# EAGLE design MYO Ganglion no usb (EAGLE 6.1)

## Sheet 1 of 2
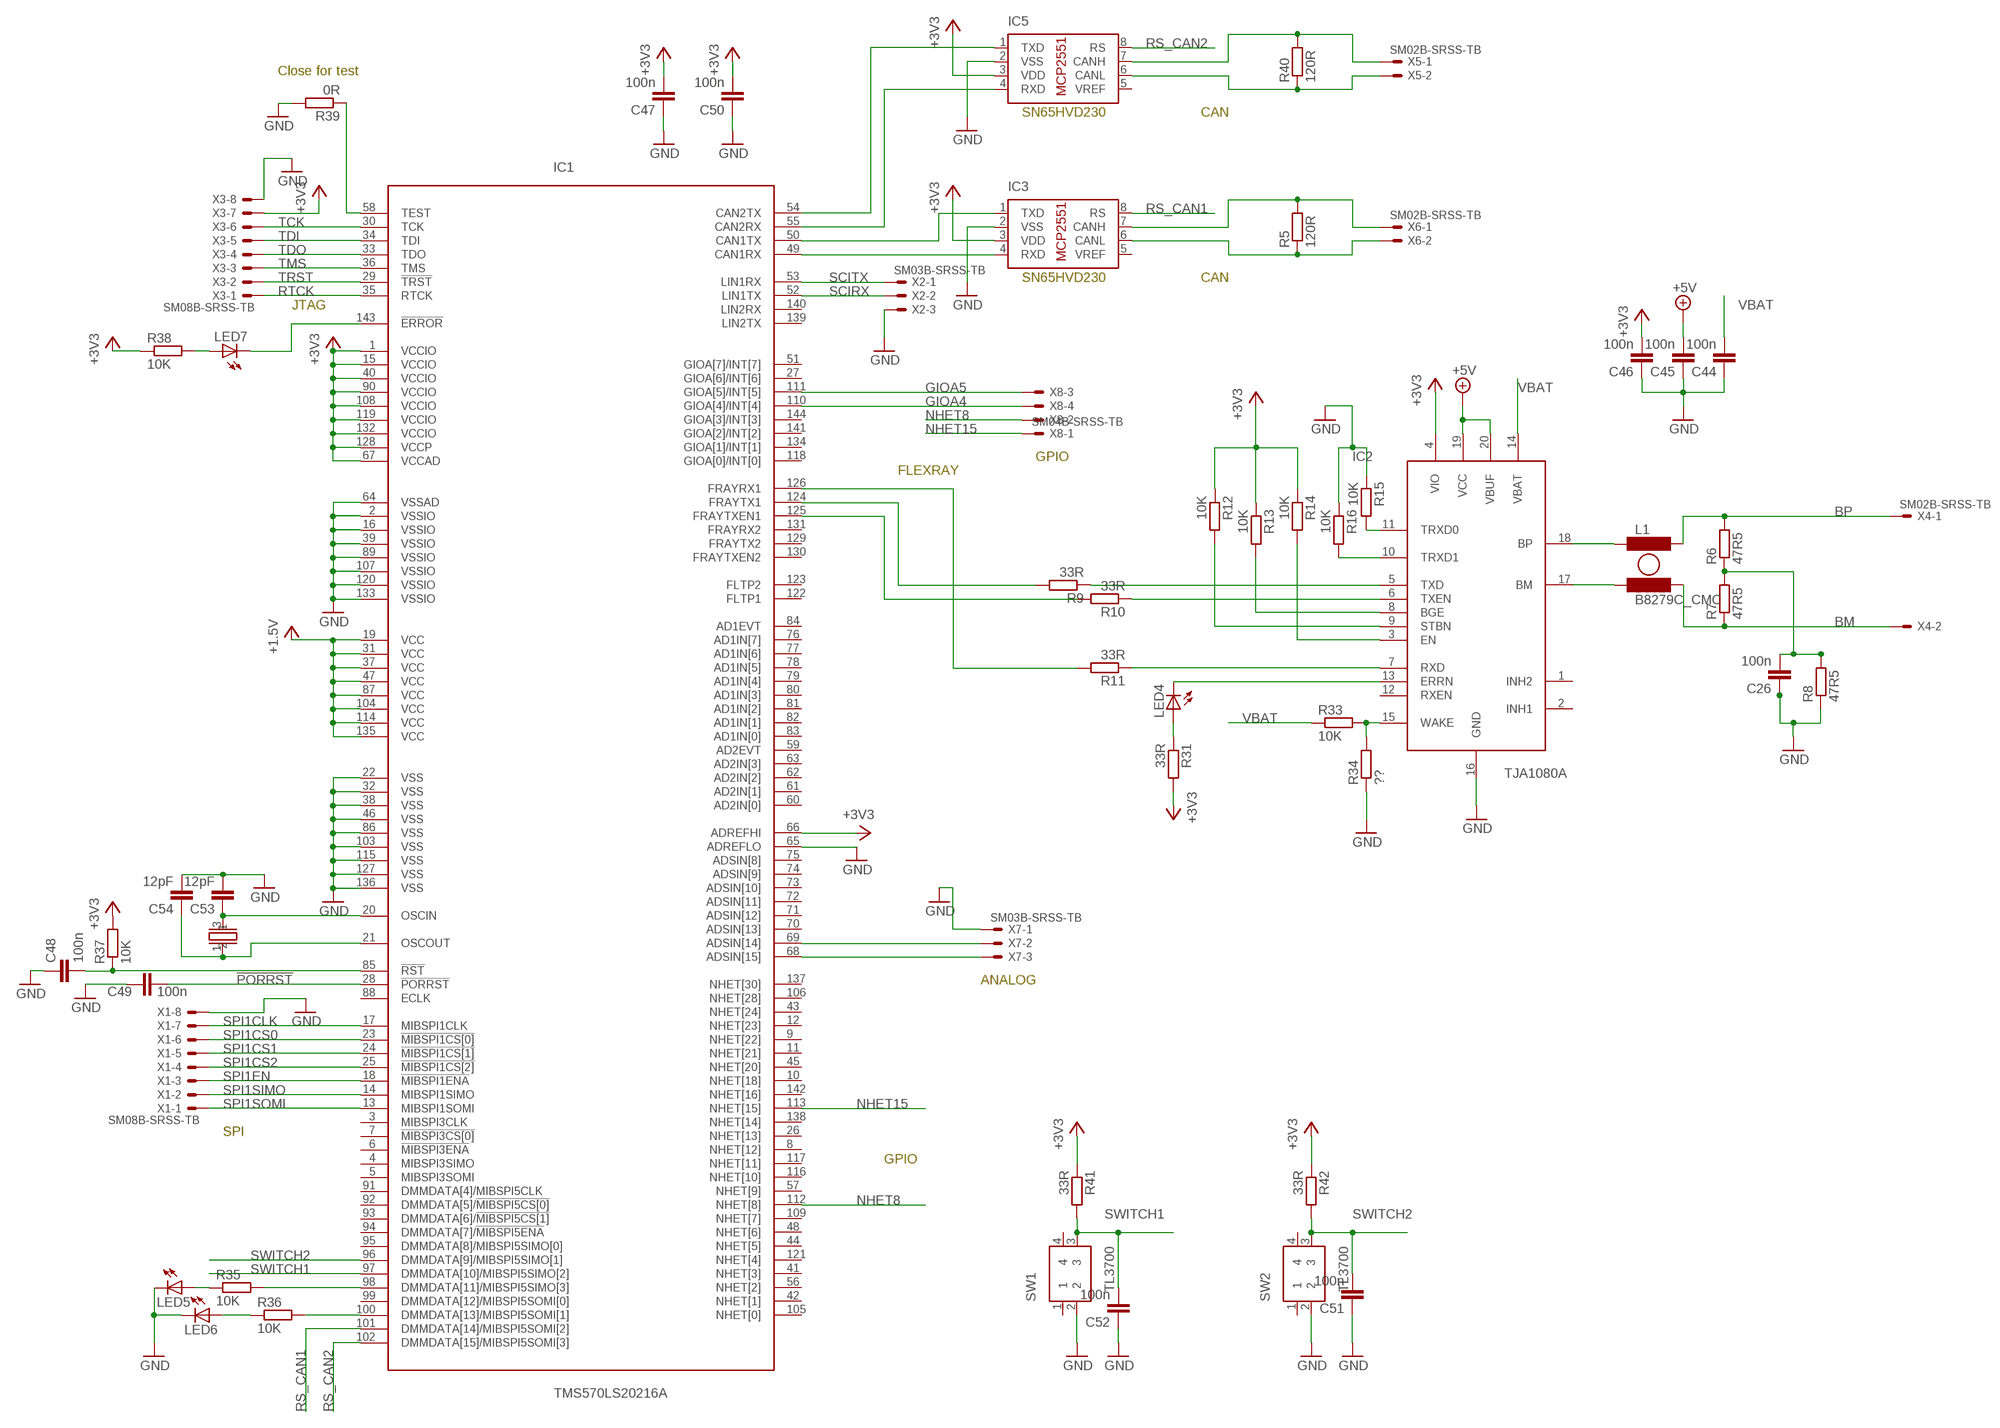
[diagram p0: schematic, sheet 1]

### Parts
C26  100n  C-EUC0402K  [C0402K]
C44  100n  C-EUC0402K  [C0402K]
C45  100n  C-EUC0402K  [C0402K]
C46  100n  C-EUC0402K  [C0402K]
C47  100n  C-EUC0402K  [C0402K]
C48  100n  C-EUC0402K  [C0402K]
C49  100n  C-EUC0402K  [C0402K]
C50  100n  C-EUC0402K  [C0402K]
C51  100n  C-EUC0402K  [C0402K]
C52  100n  C-EUC0402K  [C0402K]
C53  12pF  C-EUC0402K  [C0402K]
C54  12pF  C-EUC0402K  [C0402K]
IC1  TMS570LS20216A  [PQFP144]
IC2  TJA1080A  [TSSOP20]
IC3  MCP2551/SN  [SO08]
IC5  MCP2551/SN  [SO08]
L1  B8279C_CMC  [1812CMC]
LED4  LEDCHIPLED_0805  [CHIPLED_0805]
LED5  LEDCHIPLED_0805  [CHIPLED_0805]
LED6  LEDCHIPLED_0805  [CHIPLED_0805]
LED7  LEDCHIPLED_0805  [CHIPLED_0805]
R5  120R  R-EU_R0603  [R0603]
R6  47R5  R-EU_R0402  [R0402]
R7  47R5  R-EU_R0402  [R0402]
R8  47R5  R-EU_R0402  [R0402]
R9  33R  R-EU_R0402  [R0402]
R10  33R  R-EU_R0402  [R0402]
R11  33R  R-EU_R0402  [R0402]
R12  10K  R-EU_R0402  [R0402]
R13  10K  R-EU_R0402  [R0402]
R14  10K  R-EU_R0402  [R0402]
R15  10K  R-EU_R0402  [R0402]
R16  10K  R-EU_R0402  [R0402]
R31  33R  R-EU_R0402  [R0402]
R33  10K  R-EU_R0402  [R0402]
R34  ??  R-EU_R0402  [R0402]
R35  10K  R-EU_R0402  [R0402]
R36  10K  R-EU_R0402  [R0402]
R37  10K  R-EU_R0402  [R0402]
R38  10K  R-EU_R0402  [R0402]
R39  0R  R-EU_R0402  [R0402]
R40  120R  R-EU_R0603  [R0603]
R41  33R  R-EU_R0402  [R0402]
R42  33R  R-EU_R0402  [R0402]
SW1  TL3700  [TL3700]
SW2  TL3700  [TL3700]
X1  SM08B-SRSS-TB  [SM08B-SRSS-TB]
X2  SM03B-SRSS-TB  [SM03B-SRSS-TB]
X3  SM08B-SRSS-TB  [SM08B-SRSS-TB]
X4  SM02B-SRSS-TB  [SM02B-SRSS-TB]
X5  SM02B-SRSS-TB  [SM02B-SRSS-TB]
X6  SM02B-SRSS-TB  [SM02B-SRSS-TB]
X7  SM03B-SRSS-TB  [SM03B-SRSS-TB]
X8  SM04B-SRSS-TB  [SM04B-SRSS-TB]
XT1  2.5X2_XTAL  [2.5X2_XTAL]

### Nets
!PORRST: C49.2 IC1.28(!PORRST) ; also sheet 2
+1V5: IC1.19(VCC) IC1.31(VCC) IC1.37(VCC) IC1.47(VCC) IC1.87(VCC) IC1.104(VCC) IC1.114(VCC) IC1.135(VCC) ; supply symbol labelled +1.5V ; also sheet 2
+3V3 [power]: C46.2 C47.2 C50.2 IC1.1(VCCIO) IC1.15(VCCIO) IC1.40(VCCIO) IC1.66(ADREFHI) IC1.67(VCCAD) IC1.90(VCCIO) IC1.108(VCCIO) IC1.119(VCCIO) IC1.128(VCCP) IC1.132(VCCIO) IC2.4(VIO) IC3.3(VDD) IC5.3(VDD) R12.1 R13.1 R14.1 R31.2 R37.2 R38.1 R41.1 R42.1 X3.7 ; also sheet 2
+5V [power]: C45.2 IC2.19(VCC) IC2.20(VBUF) ; also sheet 2
BM: L1.4 R7.1 X4.2
BP: L1.2 R6.2 X4.1
GIOA4: IC1.110(GIOA[4]/INT[4]) X8.4
GIOA5: IC1.111(GIOA[5]/INT[5]) X8.3
GND: C26.1 C44.1 C45.1 C46.1 C47.1 C48.1 C49.1 C50.1 C51.1 C52.1 C53.2 C54.2 IC1.2(VSSIO) IC1.16(VSSIO) IC1.22(VSS) IC1.32(VSS) IC1.38(VSS) IC1.39(VSSIO) IC1.46(VSS) IC1.64(VSSAD) IC1.65(ADREFLO) IC1.86(VSS) IC1.89(VSSIO) IC1.103(VSS) IC1.107(VSSIO) IC1.115(VSS) IC1.120(VSSIO) IC1.127(VSS) IC1.133(VSSIO) IC1.136(VSS) IC2.16(GND) IC3.2(VSS) IC5.2(VSS) LED5.C LED6.C R8.1 R15.1 R16.1 R34.1 R39.2 SW1.2 SW2.2 X1.8 X2.3 X3.8 X7.1 ; also sheet 2
N$1: IC2.18(BP) L1.1
N$2: IC1.50(CAN1TX) IC3.1(TXD)
N$5: IC1.49(CAN1RX) IC3.4(RXD)
N$6: IC2.17(BM) L1.3
N$8: C53.1 IC1.20(OSCIN) XT1.3
N$9: C54.1 IC1.21(OSCOUT) XT1.1
N$10: IC3.7(CANH) R5.2 X6.1
N$11: IC3.6(CANL) R5.1 X6.2
N$12: IC2.5(TXD) R9.1
N$13: IC2.6(TXEN) R10.1
N$14: IC1.98(DMMDATA[11]/MIBSPI5SIMO[3]) R35.2
N$15: IC1.100(DMMDATA[13]/MIBSPI5SOMI[1]) R36.2
N$16: IC2.7(RXD) R11.1
N$17: C26.2 R6.1 R7.2 R8.2
N$18: IC2.9(STBN) R12.2
N$19: IC2.8(BGE) R13.2
N$20: IC2.3(EN) R14.2
N$21: IC1.68(ADSIN[15]) X7.3
N$22: IC1.69(ADSIN[14]) X7.2
N$23: IC2.11(TRXD0) R15.2
N$24: IC2.10(TRXD1) R16.2
N$55: IC1.126(FRAYRX1) R11.2
N$56: IC1.124(FRAYTX1) R9.2
N$57: IC1.125(FRAYTXEN1) R10.2
N$58: LED4.A R31.1
N$59: IC2.13(ERRN) LED4.C
N$60: IC2.15(WAKE) R33.2 R34.2
N$61: LED5.A R35.1
N$62: LED6.A R36.1
N$63: IC1.54(CAN2TX) IC5.1(TXD)
N$64: C48.2 IC1.85(!RST) R37.1
N$65: IC1.58(TEST) R39.1
N$66: IC1.143(!ERROR) LED7.C
N$67: LED7.A R38.2
N$68: IC1.55(CAN2RX) IC5.4(RXD)
N$69: IC5.7(CANH) R40.2 X5.1
N$70: IC5.6(CANL) R40.1 X5.2
NHET8: IC1.112(NHET[8]) X8.2
NHET15: IC1.113(NHET[15]) X8.1
RS_CAN1: IC1.101(DMMDATA[14]/MIBSPI5SOMI[2]) IC3.8(RS)
RS_CAN2: IC1.102(DMMDATA[15]/MIBSPI5SOMI[3]) IC5.8(RS)
RTCK: IC1.35(RTCK) X3.1
SCIRX: IC1.52(LIN1TX) X2.2
SCITX: IC1.53(LIN1RX) X2.1
SPI1CLK: IC1.17(MIBSPI1CLK) X1.7
SPI1CS0: IC1.23(!MIBSPI1CS[0]) X1.6
SPI1CS1: IC1.24(!MIBSPI1CS[1]) X1.5
SPI1CS2: IC1.25(!MIBSPI1CS[2]) X1.4
SPI1EN: IC1.18(!MIBSPI1ENA) X1.3
SPI1SIMO: IC1.14(MIBSPI1SIMO) X1.2
SPI1SOMI: IC1.13(MIBSPI1SOMI) X1.1
SWITCH1: C52.2 IC1.97(DMMDATA[10]/MIBSPI5SIMO[2]) R41.2 SW1.3
SWITCH2: C51.2 IC1.96(DMMDATA[9]/MIBSPI5SIMO[1]) R42.2 SW2.3
TCK: IC1.30(TCK) X3.6
TDI: IC1.34(TDI) X3.5
TDO: IC1.33(TDO) X3.4
TMS: IC1.36(TMS) X3.3
TRST: IC1.29(!TRST) X3.2
VBAT: C44.2 IC2.14(VBAT) R33.1 ; also sheet 2
Unconnected: IC1.3(MIBSPI3CLK) IC1.4(MIBSPI3SIMO) IC1.5(MIBSPI3SOMI) IC1.6(!MIBSPI3ENA) IC1.7(!MIBSPI3CS[0]) IC1.8(NHET[12]) IC1.9(NHET[22]) IC1.10(NHET[18]) IC1.11(NHET[21]) IC1.12(NHET[23]) IC1.26(NHET[13]) IC1.27(GIOA[6]/INT[6]) IC1.41(NHET[3]) IC1.42(NHET[1]) IC1.43(NHET[24]) IC1.44(NHET[5]) IC1.45(NHET[20]) IC1.48(NHET[6]) IC1.51(GIOA[7]/INT[7]) IC1.56(NHET[2]) IC1.57(NHET[9]) IC1.59(AD2EVT) IC1.60(AD2IN[0]) IC1.61(AD2IN[1]) IC1.62(AD2IN[2]) IC1.63(AD2IN[3]) IC1.70(ADSIN[13]) IC1.71(ADSIN[12]) IC1.72(ADSIN[11]) IC1.73(ADSIN[10]) IC1.74(ADSIN[9]) IC1.75(ADSIN[8]) IC1.76(AD1IN[7]) IC1.77(AD1IN[6]) IC1.78(AD1IN[5]) IC1.79(AD1IN[4]) IC1.80(AD1IN[3]) IC1.81(AD1IN[2]) IC1.82(AD1IN[1]) IC1.83(AD1IN[0]) IC1.84(AD1EVT) IC1.88(ECLK) IC1.91(DMMDATA[4]/MIBSPI5CLK) IC1.92(DMMDATA[5]/!MIBSPI5CS[0]) IC1.93(DMMDATA[6]/!MIBSPI5CS[1]) IC1.94(DMMDATA[7]/!MIBSPI5ENA) IC1.95(DMMDATA[8]/MIBSPI5SIMO[0]) IC1.99(DMMDATA[12]/MIBSPI5SOMI[0]) IC1.105(NHET[0]) IC1.106(NHET[28]) IC1.109(NHET[7]) IC1.116(NHET[10]) IC1.117(NHET[11]) IC1.118(GIOA[0]/INT[0]) IC1.121(NHET[4]) IC1.122(FLTP1) IC1.123(FLTP2) IC1.129(FRAYTX2) IC1.130(FRAYTXEN2) IC1.131(FRAYRX2) IC1.134(GIOA[1]/INT[1]) IC1.137(NHET[30]) IC1.138(NHET[14]) IC1.139(LIN2TX) IC1.140(LIN2RX) IC1.141(GIOA[2]/INT[2]) IC1.142(NHET[16]) IC1.144(GIOA[3]/INT[3]) IC2.1(INH2) IC2.2(INH1) IC2.12(RXEN) IC3.5(VREF) IC5.5(VREF) SW1.1 SW1.4 SW2.1 SW2.4

### Notes on the sheet
- Close for test
- SN65HVD230 | CAN
- SN65HVD230 | CAN
- JTAG
- GPIO
- FLEXRAY
- ANALOG
- SPI
- GPIO

## Sheet 2 of 2
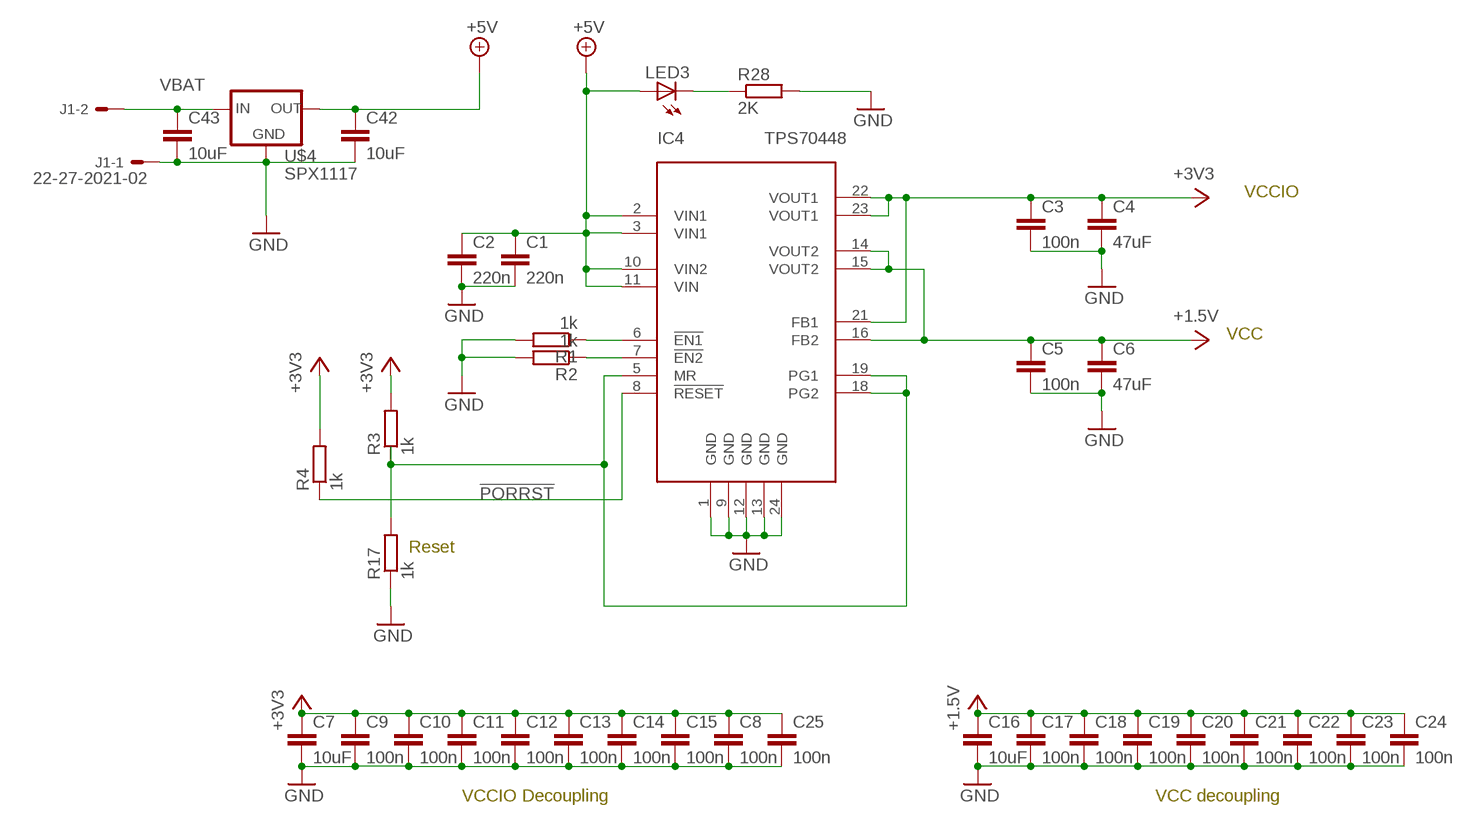
[diagram p1: schematic, sheet 2]

### Parts
C1  220n  C-EUC0402K  [C0402K]
C2  220n  C-EUC0402K  [C0402K]
C3  100n  C-EUC0402K  [C0402K]
C4  47uF  C-EUC0805K  [C0805K]
C5  100n  C-EUC0402K  [C0402K]
C6  47uF  C-EUC0805K  [C0805K]
C7  10uF  C-EUC0805K  [C0805K]
C8  100n  C-EUC0402K  [C0402K]
C9  100n  C-EUC0402K  [C0402K]
C10  100n  C-EUC0402K  [C0402K]
C11  100n  C-EUC0402K  [C0402K]
C12  100n  C-EUC0402K  [C0402K]
C13  100n  C-EUC0402K  [C0402K]
C14  100n  C-EUC0402K  [C0402K]
C15  100n  C-EUC0402K  [C0402K]
C16  10uF  C-EUC0805K  [C0805K]
C17  100n  C-EUC0402K  [C0402K]
C18  100n  C-EUC0402K  [C0402K]
C19  100n  C-EUC0402K  [C0402K]
C20  100n  C-EUC0402K  [C0402K]
C21  100n  C-EUC0402K  [C0402K]
C22  100n  C-EUC0402K  [C0402K]
C23  100n  C-EUC0402K  [C0402K]
C24  100n  C-EUC0402K  [C0402K]
C25  100n  C-EUC0402K  [C0402K]
C42  10uF  C-EUC0805K  [C0805K]
C43  10uF  C-EUC0805K  [C0805K]
IC4  TPS70448  TPS703XX  [HTSSOP24PWP]
J1  22-27-2021-02  [6410-02]
LED3  LEDCHIPLED_0805  [CHIPLED_0805]
R1  1k  R-EU_R0402  [R0402]
R2  1k  R-EU_R0402  [R0402]
R3  1k  R-EU_R0402  [R0402]
R4  1k  R-EU_R0402  [R0402]
R17  1k  R-EU_R0402  [R0402]
R28  2K  R-EU_R0402  [R0402]
U$4  SPX1117  [SOT223]

### Nets
!PORRST: IC4.8(!RESET) R4.1 ; also sheet 1
+1V5: C5.1 C6.1 C16.1 C17.1 C18.1 C19.1 C20.1 C21.1 C22.1 C23.1 C24.1 IC4.14(VOUT2) IC4.15(VOUT2) IC4.16(FB2) ; supply symbol labelled +1.5V ; also sheet 1
+3V3 [power]: C3.1 C4.1 C7.1 C8.1 C9.1 C10.1 C11.1 C12.1 C13.1 C14.1 C15.1 C25.1 IC4.21(FB1) IC4.22(VOUT1) IC4.23(VOUT1) R3.2 R4.2 ; also sheet 1
+5V [power]: C1.1 C2.1 C42.1 IC4.2(VIN1) IC4.3(VIN1) IC4.10(VIN2) IC4.11(VIN) LED3.A U$4.2(OUT) ; also sheet 1
GND: C1.2 C2.2 C3.2 C4.2 C5.2 C6.2 C7.2 C8.2 C9.2 C10.2 C11.2 C12.2 C13.2 C14.2 C15.2 C16.2 C17.2 C18.2 C19.2 C20.2 C21.2 C22.2 C23.2 C24.2 C25.2 C42.2 C43.2 IC4.1(GND) IC4.9(GND) IC4.12(GND) IC4.13(GND) IC4.24(GND) J1.1 R1.2 R2.2 R17.1 R28.2 U$4.1(GND) ; also sheet 1
N$3: IC4.6(!EN1) R1.1
N$4: IC4.7(!EN2) R2.1
N$7: IC4.5(MR) IC4.18(PG2) IC4.19(PG1) R3.1 R17.2
N$53: LED3.C R28.1
VBAT: C43.1 J1.2 U$4.3(IN) ; also sheet 1

### Notes on the sheet
- VCCIO
- VCC
- Reset
- VCCIO Decoupling | VCC decoupling

## Library data of the parts
C1-C26 C42-C54 = rcl:C-EU: CAPACITOR, European symbol
IC1 = texas:TMS570LS20216A
IC2 = NXP:TJA1080A
IC3 IC5 = microchip-dspic:MCP2551: High-Speed CAN Transceiver
IC4 = texas:TPS703XX
J1 = con-molex:22-?-02: CONNECTOR wire to board 2.54 mm (.1 inch) pitch header; OC_FARNELL: unknown; OC_NEWARK: unknown
L1 = jas new (2):B8279C_CMC
LED3-LED7 = led:LED: LED OSRAM: - CHIPLED LG R971, LG N971, LY N971, LG Q971, LY Q971, LO R971, LY R971 LH N974, LH R974 LS Q976, LO Q976, LY Q976 LO Q996 - Hyper CHIPLED LW Q18S LB Q993, LB Q99A, LB R99A - SideLED LS A670, LO A670, LY A670, LG A670, LP A670 LB A673, LV A673, LT A673, LW A673 LH A674 LY A675 LS A676, LA A676, LO A676, LY A676, LW A676 LS A679, LY A679, LG A679 - Hyper Micro SIDELED® LS Y876, LA Y876, LO Y876, LY Y876 LT Y87S - SmartLED LW L88C, LW L88S LB L89C, LB L89S, LG L890 LS L89K, LO L89K, LY L89K LS L896, LA L896, LO L896, LY L896 - TOPLED LS T670, LO T670, LY T670, LG T670, LP T670 LSG T670, LSP T670, LSY T670, LOP T670, LYG T670 LG T671, LOG T671, LSG T671 LB T673, LV T673, LT T673, LW T673 LH T674 LS T676, LA T676, LO T676, LY T676, LB T676, LH T676, LSB T676, LW T676 LB T67C, LV T67C, LT T67C, LS T67K, LO T67K, LY T67K, LW E67C LS E67B, LA E67B, LO E67B, LY E67B, LB E67C, LV E67C, LT E67C LW T67C LS T679, LY T679, LG T679 LS T770, LO T770, LY T770, LG T770, LP T770 LB T773, LV T773, LT T773, LW T773 LH T774 LS E675, LA E675, LY E675, LS T675 LS T776, LA T776, LO T776, LY T776, LB T776 LHGB T686 LT T68C, LB T68C - Hyper Mini TOPLED® LB M676 - Mini TOPLED Santana® LG M470 LS M47K, LO M47K, LY M47K Source: http://www.osram.convergy.de LUXEON: - LUMILED® LXK2-PW12-R00, LXK2-PW12-S00, LXK2-PW14-U00, LXK2-PW14-V00 LXK2-PM12-R00, LXK2-PM12-S00, LXK2-PM14-U00 LXK2-PE12-Q00, LXK2-PE12-R00, LXK2-PE12-S00, LXK2-PE14-T00, LXK2-PE14-U00 LXK2-PB12-K00, LXK2-PB12-L00, LXK2-PB12-M00, LXK2-PB14-N00, LXK2-PB14-P00, LXK2-PB14-Q00 LXK2-PR12-L00, LXK2-PR12-M00, LXK2-PR14-Q00, LXK2-PR14-R00 LXK2-PD12-Q00, LXK2-PD12-R00, LXK2-PD12-S00 LXK2-PH12-R00, LXK2-PH12-S00 LXK2-PL12-P00, LXK2-PL12-Q00, LXK2-PL12-R00 Source: www.luxeon.com KINGBRIGHT: KA-3528ASYC Source: www.kingbright.com
R1-R17 R28 R31 R33-R42 = rcl:R-EU_: RESISTOR, European symbol
SW1 SW2 = jas new (2):TL3700
U$4 = v-reg:SPX1117
X1 X3 = con-jst2:?M08B-SRSS-TB: Disconnectable Crimp style connector, 1.0mm pitch 8 contacts
X2 X7 = con-jst2:?M03B-SRSS-TB: Disconnectable Crimp style connector, 1.0mm pitch 3 contacts
X4-X6 = con-jst2:?M02B-SRSS-TB: Disconnectable Crimp style connector, 1.0mm pitch 2 contacts
X8 = con-jst2:?M04B-SRSS-TB: Disconnectable Crimp style connector, 1.0mm pitch 4 contacts
XT1 = jas new (2):2.5X2_XTAL

## Net classes
1 power: width 0.305 mm, drill 0.203 mm, clearance 0.127 mm

## Board
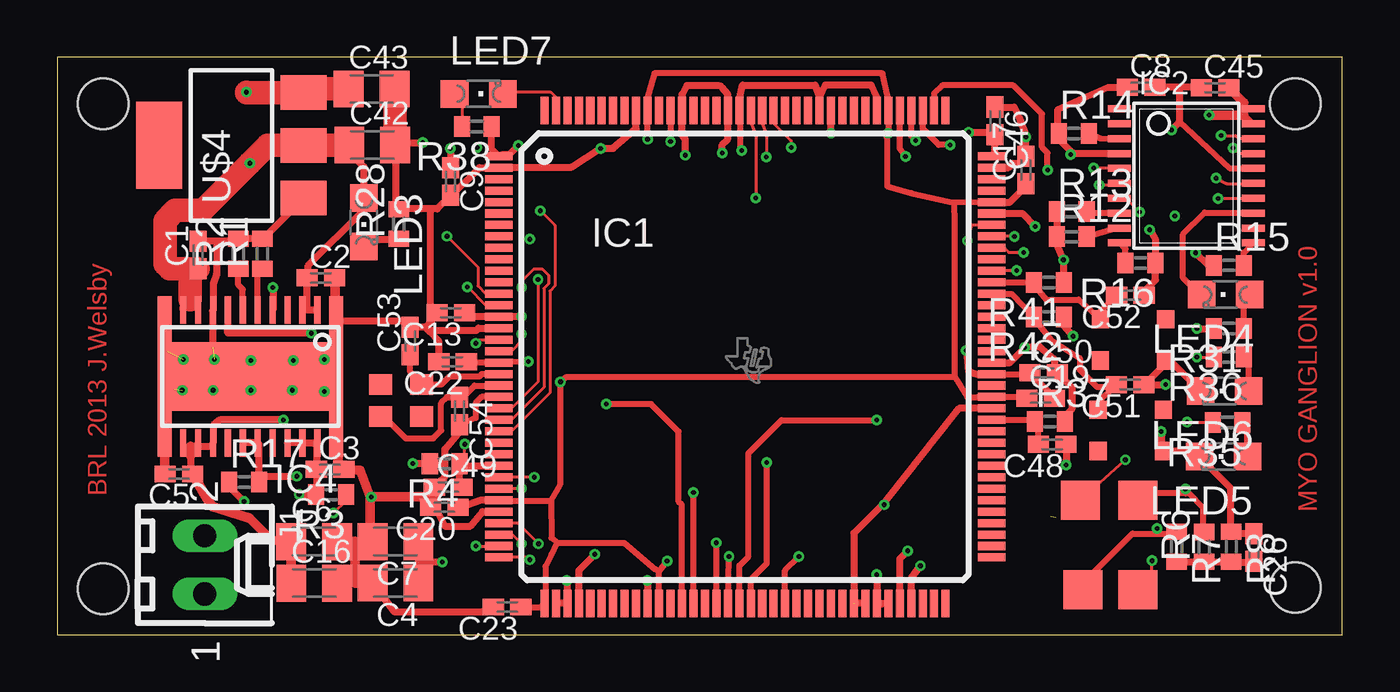
[diagram p2: board, top side]
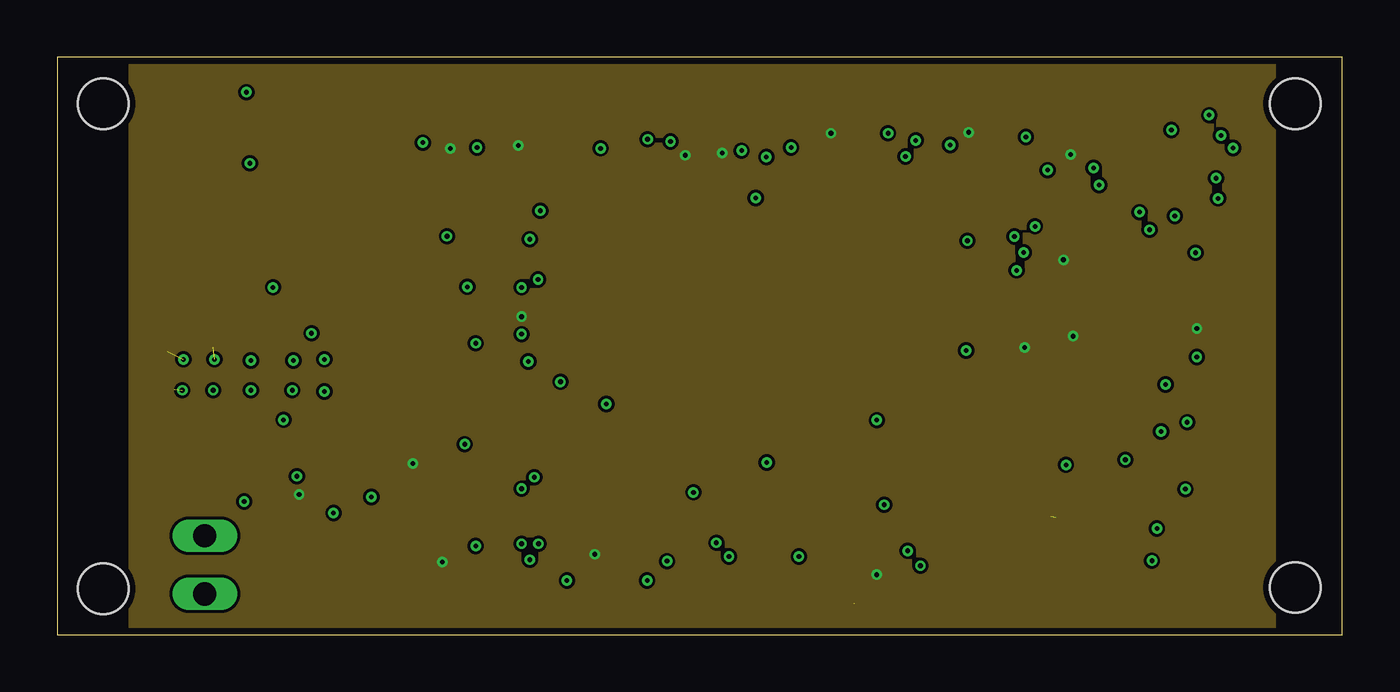
[diagram p3: board, inner layer Route2]
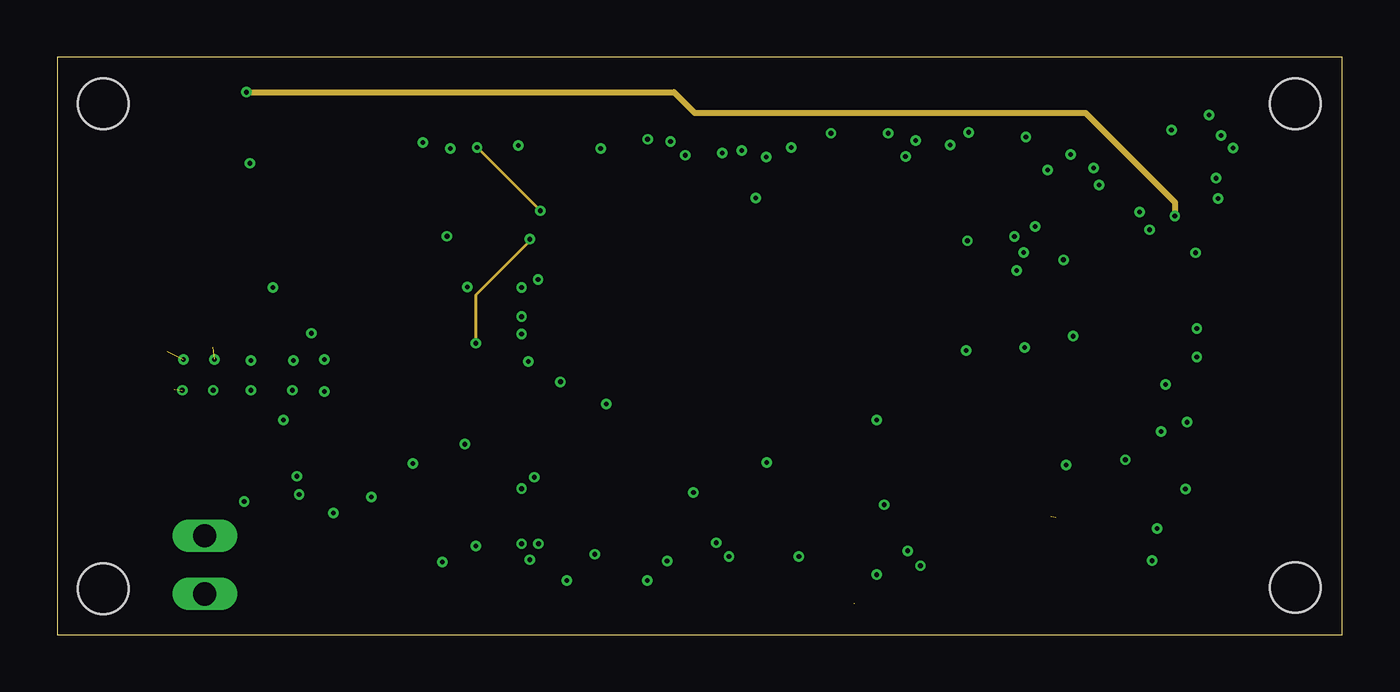
[diagram p4: board, inner layer Route15]
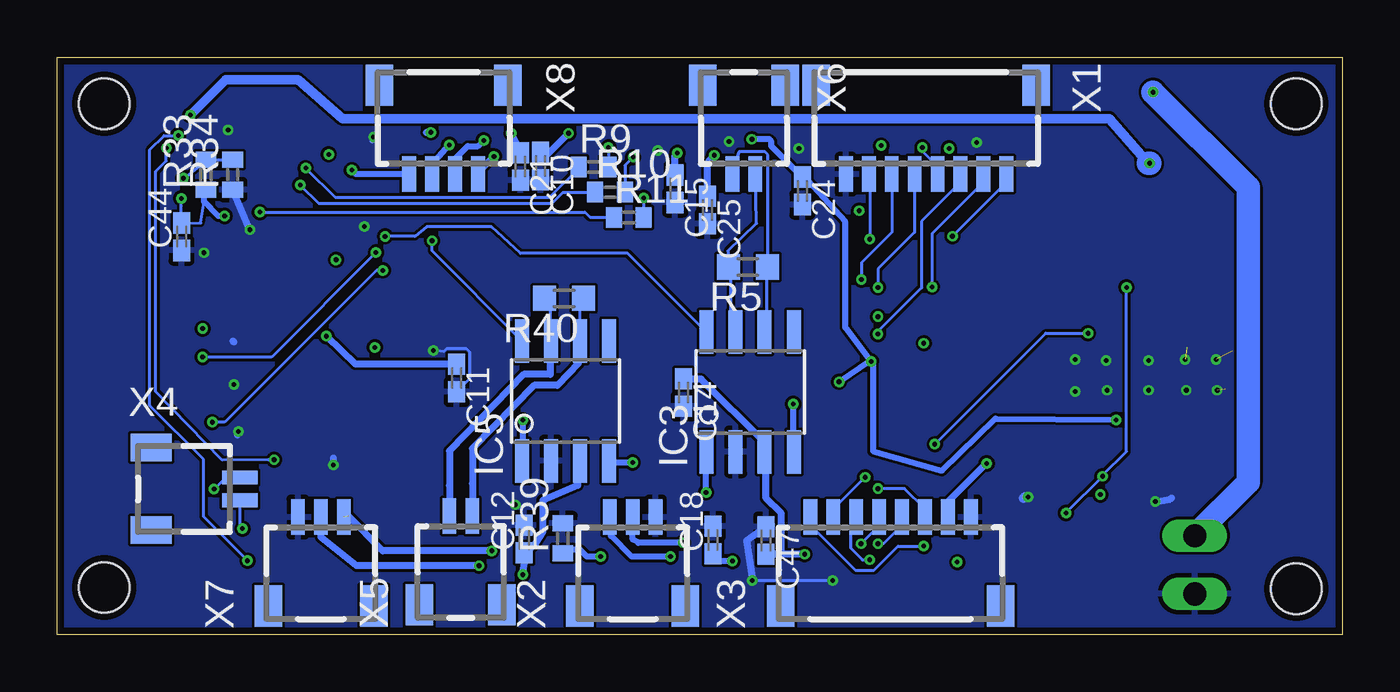
[diagram p5: board, bottom side, seen from below]

Size 56.05 x 25.17 mm. Coordinates in mm from the lower left corner, seen from the top.
Outline: 0,0 56.05,0 56.05,25.17 0,25.17 0,0
Copper layers (1*2+15*16): Top 0.035mm / dielectric 1.5mm / Route2 0.035mm / dielectric 0.15mm / Route15 0.035mm / dielectric 0.2mm / Bottom 0.035mm
Design rules: minimum track width 0.125mm, minimum drill 0.2mm, track to track 0.125mm, track to pad 0.125mm, pad to pad 0.125mm, via to via 0.125mm, smd to smd 0.125mm, copper to edge 0.3mm, drill to drill 0.2mm, minimum pad ring 0.2mm, minimum via ring 0.125mm, stop-mask expansion 0.075mm, vias tented up to drill 0mil, thermal gap 0.2mm
Holes 2.2 mm at 2,2 54,2.05 2,23.15 54,23.15

### Footprints (pad centres in the part's own frame; a part is rotated, then mirrored left to right if it is on the bottom)
C0402K = smd 0.925 x 0.74: 1 -0.6,0; 2 0.6,0
C0805K = smd 1.3 x 1.6: 1 -1,0; 2 1,0
PQFP144 = smd 1.2 x 0.35: 1 -10.75,8.75; 2 -10.75,8.25; 3 -10.75,7.75; 4 -10.75,7.25; 5 -10.75,6.75; 6 -10.75,6.25; 7 -10.75,5.75; 8 -10.75,5.25; 9 -10.75,4.75; 10 -10.75,4.25; 11 -10.75,3.75; 12 -10.75,3.25; 13 -10.75,2.75; 14 -10.75,2.25; 15 -10.75,1.75; 16 -10.75,1.25; 17 -10.75,0.75; 18 -10.75,0.25; 19 -10.75,-0.25; 20 -10.75,-0.75; 21 -10.75,-1.25; 22 -10.75,-1.75; 23 -10.75,-2.25; 24 -10.75,-2.75; 25 -10.75,-3.25; 26 -10.75,-3.75; 27 -10.75,-4.25; 28 -10.75,-4.75; 29 -10.75,-5.25; 30 -10.75,-5.75; 31 -10.75,-6.25; 32 -10.75,-6.75; 33 -10.75,-7.25; 34 -10.75,-7.75; 35 -10.75,-8.25; 36 -10.75,-8.75; 73 10.75,-8.75; 74 10.75,-8.25; 75 10.75,-7.75; 76 10.75,-7.25; 77 10.75,-6.75; 78 10.75,-6.25; 79 10.75,-5.75; 80 10.75,-5.25; 81 10.75,-4.75; 82 10.75,-4.25; 83 10.75,-3.75; 84 10.75,-3.25; 85 10.75,-2.75; 86 10.75,-2.25; 87 10.75,-1.75; 88 10.75,-1.25; 89 10.75,-0.75; 90 10.75,-0.25; 91 10.75,0.25; 92 10.75,0.75; 93 10.75,1.25; 94 10.75,1.75; 95 10.75,2.25; 96 10.75,2.75; 97 10.75,3.25; 98 10.75,3.75; 99 10.75,4.25; 100 10.75,4.75; 101 10.75,5.25; 102 10.75,5.75; 103 10.75,6.25; 104 10.75,6.75; 105 10.75,7.25; 106 10.75,7.75; 107 10.75,8.25; 108 10.75,8.75 | smd 0.35 x 1.2: 37 -8.75,-10.75; 38 -8.25,-10.75; 39 -7.75,-10.75; 40 -7.25,-10.75; 41 -6.75,-10.75; 42 -6.25,-10.75; 43 -5.75,-10.75; 44 -5.25,-10.75; 45 -4.75,-10.75; 46 -4.25,-10.75; 47 -3.75,-10.75; 48 -3.25,-10.75; 49 -2.75,-10.75; 50 -2.25,-10.75; 51 -1.75,-10.75; 52 -1.25,-10.75; 53 -0.75,-10.75; 54 -0.25,-10.75; 55 0.25,-10.75; 56 0.75,-10.75; 57 1.25,-10.75; 58 1.75,-10.75; 59 2.25,-10.75; 60 2.75,-10.75; 61 3.25,-10.75; 62 3.75,-10.75; 63 4.25,-10.75; 64 4.75,-10.75; 65 5.25,-10.75; 66 5.75,-10.75; 67 6.25,-10.75; 68 6.75,-10.75; 69 7.25,-10.75; 70 7.75,-10.75; 71 8.25,-10.75; 72 8.75,-10.75; 109 8.75,10.75; 110 8.25,10.75; 111 7.75,10.75; 112 7.25,10.75; 113 6.75,10.75; 114 6.25,10.75; 115 5.75,10.75; 116 5.25,10.75; 117 4.75,10.75; 118 4.25,10.75; 119 3.75,10.75; 120 3.25,10.75; 121 2.75,10.75; 122 2.25,10.75; 123 1.75,10.75; 124 1.25,10.75; 125 0.75,10.75; 126 0.25,10.75; 127 -0.25,10.75; 128 -0.75,10.75; 129 -1.25,10.75; 130 -1.75,10.75; 131 -2.25,10.75; 132 -2.75,10.75; 133 -3.25,10.75; 134 -3.75,10.75; 135 -4.25,10.75; 136 -4.75,10.75; 137 -5.25,10.75; 138 -5.75,10.75; 139 -6.25,10.75; 140 -6.75,10.75; 141 -7.25,10.75; 142 -7.75,10.75; 143 -8.25,10.75; 144 -8.75,10.75
TSSOP20 = smd 0.305 x 0.991: 1 -2.925,-2.918; 2 -2.275,-2.918; 3 -1.625,-2.918; 4 -0.975,-2.918; 5 -0.325,-2.918; 6 0.325,-2.918; 7 0.975,-2.918; 8 1.625,-2.918; 9 2.275,-2.918; 10 2.925,-2.918; 11 2.925,2.918; 12 2.275,2.918; 13 1.625,2.918; 14 0.975,2.918; 15 0.325,2.918; 16 -0.325,2.918; 17 -0.975,2.918; 18 -1.625,2.918; 19 -2.275,2.918; 20 -2.925,2.918
SO08 = smd 0.61 x 1.905: 1 -1.905,-2.616; 2 -0.635,-2.616; 3 0.635,-2.616; 4 1.905,-2.616; 5 1.905,2.616; 6 0.635,2.616; 7 -0.635,2.616; 8 -1.905,2.616
HTSSOP24PWP = smd 0.61 x 2.1: 1 -3.745,-2.45; 12 3.745,-2.45; 13 3.745,2.45; 24 -3.745,2.45 | smd 0.27 x 1.2: 2 -2.925,-2.9; 3 -2.275,-2.9; 4 -1.625,-2.9; 5 -0.975,-2.9; 6 -0.325,-2.9; 7 0.325,-2.9; 8 0.975,-2.9; 9 1.625,-2.9; 10 2.275,-2.9; 11 2.925,-2.9; 14 2.925,2.9; 15 2.275,2.9; 16 1.625,2.9; 17 0.975,2.9; 18 0.325,2.9; 19 -0.325,2.9; 20 -0.975,2.9; 21 -1.625,2.9; 22 -2.275,2.9; 23 -2.925,2.9 | smd 8.1 x 3: EXP 0,0
6410-02 = drill 1.016 long: 1 1.27,0; 2 -1.27,0
1812CMC = smd 1.7 x 1.7: 1 -1.2,2; 2 -1.2,-1.9; 3 1.3,-1.9; 4 1.2,2
CHIPLED_0805 = smd 1.2 x 1.2: A 0,-1.05; C 0,1.05
R0402 = smd 0.7 x 0.9: 1 -0.65,0; 2 0.65,0
R0603 = smd 1 x 1.1: 1 -0.85,0; 2 0.85,0
TL3700 = smd 0.75 x 0.8: 1 0,0; 2 2.85,0; 3 0,1.8; 4 2.85,1.8
SOT223 = smd 1.5 x 2: 1 -2.3,-3.15; 2 0,-3.15; 3 2.3,-3.15 | smd 3.8 x 2: 4 0,3.15
SM08B-SRSS-TB = smd 0.6 x 1.55: 1 -3.5,2.975; 2 -2.5,2.975; 3 -1.5,2.975; 4 -0.5,2.975; 5 0.5,2.975; 6 1.5,2.975; 7 2.5,2.975; 8 3.5,2.975 | smd 1.2 x 1.8: FIT@1 -4.8,-0.9; FIT@2 4.8,-0.9
SM03B-SRSS-TB = smd 0.6 x 1.55: 1 -1,2.975; 2 0,2.975; 3 1,2.975 | smd 1.2 x 1.8: FIT@1 -2.3,-0.9; FIT@2 2.3,-0.9
SM02B-SRSS-TB = smd 0.6 x 1.55: 1 -0.5,2.975; 2 0.5,2.975 | smd 1.2 x 1.8: FIT@1 -1.8,-0.9; FIT@2 1.8,-0.9
SM04B-SRSS-TB = smd 0.6 x 1.55: 1 -1.5,2.975; 2 -0.5,2.975; 3 0.5,2.975; 4 1.5,2.975 | smd 1.2 x 1.8: FIT@1 -2.8,-0.9; FIT@2 2.8,-0.9
2.5X2_XTAL = smd 1 x 0.9: 1 -0.9,-0.7; 2 0.9,-0.7; 3 0.9,0.7; 4 -0.9,0.7

### Placement (x,y rotation side)
C1  6.15,16.55 90 top
C2  11.5,15.55 0 top
C3  11.9,7.2 0 top
C4  14.75,2.25 180 top
C5  5.3,7 180 top
C6  11.2,4.05 0 top
C7  14.75,4.05 180 top
C8  47.28,23.87 0 top
C9  17.15,19.75 270 top
C10  34.97,20.43 270 bottom
C11  38.63,11.19 270 bottom
C12  35.68,4.16 90 bottom
C13  17.17,14.03 180 top
C14  28.73,10.55 270 bottom
C15  29.1,19.44 270 bottom
C16  11.21,2.24 0 top
C17  42.25,20.26 90 top
C18  27.45,4.12 90 bottom
C19  42.9,10.3 0 top
C20  16.88,5.55 180 top
C21  35.85,20.41 270 bottom
C22  17.24,11.9 180 top
C23  19.62,1.2 180 top
C24  23.55,19.35 270 bottom
C25  27.68,18.51 270 bottom
C26  52.2,3.8 270 top
C42  13.74,21.35 0 top
C43  13.71,23.79 0 top
C44  50.63,17.35 90 bottom
C45  50.5,23.84 0 top
C46  40.91,22.4 270 top
C47  25.13,4.1 270 bottom
C48  43.4,8.29 180 top
C49  17.05,6.43 0 top
C50  43.02,11.41 0 top
C51  46.8,10.9 180 top
C52  46.81,14.79 180 top
C53  15.4,12.8 90 top
C54  17.55,9.75 270 top
IC1  30,12.11 0 top
IC2  49.25,20 270 top
IC3  25.83,10.58 0 bottom
IC4  8.42,11.25 180 top
IC5  33.88,10.19 0 bottom
J1  6.43,3.04 270 top
L1  45.93,3.96 180 top
LED3  13.38,17.98 180 top
LED4  50.96,14.82 90 top
LED5  50.87,7.77 90 top
LED6  50.92,10.62 90 top
LED7  18.38,23.58 270 top
R1  8.95,16.6 90 top
R2  7.9,16.6 90 top
R3  11.95,6.1 180 top
R4  16.9,7.45 180 top
R5  25.93,16.03 180 bottom
R6  50.03,3.82 90 top
R7  48.82,3.83 270 top
R8  51.21,3.83 270 top
R9  32.66,20.39 0 bottom
R10  31.94,19.29 0 bottom
R11  31.12,18.19 0 bottom
R12  44.25,17.35 0 top
R13  44.25,18.45 0 top
R14  44.35,21.85 0 top
R15  51.1,16.1 0 top
R16  47.25,16.2 180 top
R17  8.15,6.65 0 top
R28  14.9,17.9 90 top
R31  51.1,13.34 180 top
R33  49.57,20.05 90 bottom
R34  48.4,20.05 90 bottom
R35  51.05,9.25 180 top
R36  51.1,12.1 180 top
R37  43.3,9.29 0 top
R38  18.3,22.15 180 top
R39  34,4.2 90 bottom
R40  33.94,14.66 180 bottom
R41  43.25,15.35 180 top
R42  43.25,13.85 180 top
SW1  45.5,11.95 0 top
SW2  45.4,8 0 top
U$4  7.6,21.33 90 top
X1  18.15,23.05 180 bottom
X2  30.95,2.15 0 bottom
X3  19.7,2.15 0 bottom
X4  51.05,6.35 270 bottom
X5  38.45,2.2 0 bottom
X6  26.1,23.05 180 bottom
X7  44.55,2.15 0 bottom
X8  39.2,23.05 180 bottom
XT1  15,10.2 0 top

### Tracks (layer width: path | path; a pad name or v marks a point on that pad's centre or on a via)
!PORRST  (via drill 0.2)
  Top 0.127: C49.2 17.55,6.48 | 17.61,7.36 R4.1 17.77,7.42 v17.77,8.3 | 7.45,13.78 IC4.8
  Top 0.305: 17.55,6.48 R4.1 | 17.61,7.36 IC1.28 | 7.45,13.78 7.44,13.14 v11.09,13.14
  Bottom 0.127: v11.09,13.14 12.93,13.14 v17.77,8.3
+1V5  (via drill 0.2)
  Top 0.127: 40.15,10.35 40.63,10.4 IC1.87 | 40.69,18.84 40.17,18.84 | 36.29,22.82 IC1.114 36.23,22.92 36.23,23.44 | 25.75,23.42 IC1.135 | 36.19,21.7 v36.24,21.86 | 5.81,7.25 C5.1 5.92,6.95 | 5.56,7.99 IC4.14 | 5.85,8 5.81,7.8 | 6.21,8.21 IC4.15 | C6.1 10.17,4.1 | 19.85,11.9 19.37,11.9 IC1.19 | 17.63,5.56 C20.1 | 19.48,5.84 19.31,5.84 IC1.31 | 21.29,1.48 IC1.37 | 6.81,9.12 6.81,9.07 | 39.13,11.24 39.14,11.26 | 21.96,11.04 v21.95,11.02
  Top 0.254: IC1.19 17.88,11.86 C22.1 | IC1.87 42.31,10.36 C19.1 | C23.1 21.09,1.2 IC1.37 | IC1.47 26.25,2.75 | 26.25,2.75 v26.6,3.2 | 40.15,10.35 39.7,10.35 39.14,11.26 39.14,17.96 39.11,18.83 | 40.17,18.84 39.11,18.83 | 36.29,22.82 v36.24,21.86 | 25.75,23.42 26.05,24.47 36,24.47 36.23,23.44 | 36.19,21.7 36.2,19.55 37.25,19.25 39.11,18.83 | v20.55,11.91 20.36,11.91 19.85,11.9 | 21.29,1.48 21.29,2.97 21.55,3.48 21.8,4 | 21.8,4 21.55,4.22 21.53,5.84 | 19.48,5.84 21.53,5.84 | 21.8,4 24.73,4 26.08,2.85 26.23,2.75 26.25,2.75 | v21.95,11.02 21.95,6.56 21.53,5.84 | 39.13,11.24 22.21,11.24 21.96,11.04 | v25.75,21.6 25.75,22.7
  Top 0.305: 40.69,18.84 IC1.104 41.56,18.86 42.3,19.6 42.3,19.65 C17.1 | 5.81,7.8 5.81,7.25 | 5.81,8.22 6.03,7.99 IC4.15 | 5.85,8 5.56,7.99 | 6.21,8.21 6.79,8.21 IC4.16 6.81,9.07 | 17.63,5.56 18.49,5.86 IC1.31 | 6.81,9.12 7.1,9.36 v9.87,9.36
  Top 0.406: 5.81,7.8 5.81,8.22 | C6.1 C16.1 | 5.92,6.95 6.73,5.6 8.4,5.08 9.35,4.12 10.17,4.1
  Bottom 0.127: 35.84,21.12 C21.1 | 23.55,20.06 C24.1 | 20.57,11.95 v20.55,11.91 20.39,11.98 20.48,11.88
  Bottom 0.254: v26.6,3.2 27.38,3.2 C18.1 | v36.24,21.86 35.84,21.12 | 23.55,20.06 21.68,17.99 21.68,13.39 v20.55,11.91 | v21.95,11.02 20.57,11.95 | v9.87,9.36 15.12,9.41 17.46,7.15 20.46,8 20.48,11.88 | C24.1 24.9,21.3 24.9,21.5 25,21.6 v25.75,21.6
+3V3  (via drill 0.2)
  Top 0.305: C13.1 17.79,13.86 IC1.15 v20.25,13.86 | IC1.90 41.56,11.86 42.25,12.55 | 42.25,12.55 42.85,12.55 43.5,12 43.5,11.38 C50.2 44.25,10.78 44.25,9.82 43.95,9.52 R37.2 | IC1.40 22.75,2.8 v23.45,3.5 | IC1.108 40.91,21.02 C46.2 40.79,21.88 39.77,21.88 v39.75,21.9 | 44.28,21.01 44.37,20.97 46.29,20.97 46.13,20.96 IC2.4 | 44.28,21.01 43.65,21.64 43.55,21.64 R14.1 | C8.1 45.83,23.86 43.65,22.9 43.65,21.76 43.73,21.76 R14.1 | 43.78,21.79 R14.1 | IC4.21 IC4.22 10.85,8.36 IC4.23 11.31,8.2 11.31,7.34 C3.1 R3.2 v10.55,6.1 | C7.1 15.75,3.16 | 15.75,3.16 C4.1 | R13.1 R12.1 43.61,17.6 43.64,16.92 v43.89,16.34 R41.1 | 29,23.84 29.25,23.54 IC1.128 29.25,21.6 29,21.35 v29,21 | R38.1 18.95,21.16 IC1.1 19.39,20.92 19.71,20.92 v20.11,21.32 | v15.51,7.46 R4.2 | v44.31,13.01 43.91,13.46 43.91,13.9 R42.1 | v49.71,13.34 R31.2 | v17.15,21.2 C9.1 | v35.75,2.61 35.75,1.31 IC1.67 IC1.66 | v33.75,21.86 IC1.119 | v42.2,12.52 42.25,12.55 | 28.95,23.91 28.85,23.94 27.45,23.94 27.25,23.54 IC1.132 27.25,21.8 27.4,21.6 v27.4,20.9 | v16.79,3.16 15.75,3.16 | v44.21,20.94 44.28,21.01
  Bottom 0.305: v23.45,3.5 24.47,3.5 | 24.47,3.5 C47.2 | IC5.3 33.25,7.18 33.35,7.18 33.35,6.5 34.88,5.85 34.88,4.47 35.18,3.97 35.62,3.52 C12.1 35.65,3.26 v35.75,2.61 | C14.1 27.97,11.14 25.21,8.38 25.21,7.98 IC3.3 25.13,7.82 25.13,5.94 24.47,5.28 24.47,3.5 | v44.31,13.01 43.05,11.8 C11.1 | v15.51,7.46 17.19,5.78 17.19,5.14 X3.7 | 33.75,21.84 v33.75,21.86 34.68,20.93 C10.1 | C25.1 27.68,20.57 v27.4,20.9 | C15.1 29.1,20.9 v29,21 | v39.75,21.9 39.95,21.9
  pour Route2: 3.3,24.95 52.95,24.95 52.95,0.35 3.3,0.35
+5V  (via drill 0.2)
  Top 0.305: 51.75,22.95 51.75,22.65 52.12,22.27 IC2.19 | 51.75,22.95 51.75,23.19 | IC2.20 51.77,22.93 51.75,22.95 | IC4.11 5.5,14.29 5.8,14.6 6.14,14.26 IC4.10 | C42.1 12.93,20.84 13.37,20.4 LED3.A 13.33,18.88 13.33,18.48 10.95,16.1 10.95,15.7 C2.1 10.89,14.34 10.81,14.26 | 10.81,14.26 IC4.3 | IC4.2 10.91,14.16 10.81,14.26
  Top 0.406: v50.25,22.65 51.75,22.65 | 51.75,23.19 C45.2
  Top 1.016: C42.1 12.72,21.33 U$4.2 9.18,21.33 v8.4,20.55 6.35,18.5 5.15,18.5 4.7,18.05 4.7,16.15 4.9,15.95 5.7,15.95 | 5.7,15.95 C1.1 | 5.7,15.95 5.7,15.75 5.8,15.65 5.8,14.6
  Bottom 0.406: 8.45,20.55 10.15,22.5 43.6,22.5 45.55,24.2 48.7,24.2 v50.25,22.65
  Bottom 1.016: v8.4,20.55 8.45,20.55
BM  (via drill 0.2)
  Top 0.127: v47.97,4.62 47.97,4.4
  Top 0.254: L1.4 44.73,2.23 46.9,4.4 47.97,4.4 48.74,4.4 R7.1 48.8,4.5
  Bottom 0.127: v47.97,4.62 48.07,4.72 X4.2
BP  (via drill 0.2)
  Top 0.127: v49.21,6.34 49.21,6.15
  Top 0.254: R6.2 50,4.5 50,5.5 49.35,6.15 49.21,6.15 47.42,6.15 L1.2
  Bottom 0.127: v49.21,6.34 48.71,6.84 48.09,6.84 X4.1
GIOA4  (via drill 0.2)
  Top 0.254: v43.2,20.25 43.2,21 42.95,21.25 42.95,22.7 41.7,23.95 38.6,23.95 38.25,23.6 IC1.110
  Bottom 0.254: X8.4 43.02,20.07 v43.2,20.25
GIOA5  (via drill 0.2)
  Top 0.254: v38.95,21.35 38.45,21.35 37.75,22.05 IC1.111
  Bottom 0.254: X8.3 39.7,20.5 v38.95,21.35
GND  (via drill 0.2)  (4 unrouted)
  Top 0.127: 16.49,5.54 C20.2 16.43,5.56 16.41,5.58 16.41,6 16.41,6.42 C49.1 16.43,6.48 | 17.49,8.76 17.49,9.04 C54.2 | 12.24,8.53 IC4.24 12.19,8.86 12.19,9.2 | 12.24,7.25 C3.2 12.55,7.18 12.59,7.18 | 12.99,4.06 C7.2 13.65,4.17 | C6.2 | C4.2 13.69,2.24 | 12.99,2.24 C16.2 12.15,2.22 11.91,2.22 | 33.25,23.42 IC1.120 | IC1.115 35.75,23.42 | IC1.133 26.75,22.3 | 29.77,23.44 29.77,22.92 IC1.127 | 14.73,23.76 C43.2 | C42.2 14.77,21.3 | R28.2 14.89,18.62 14.77,18.74 | C9.2 17.21,19.16 | 12.11,13.74 IC4.1 12.21,13.66 | C2.2 | C22.2 | 16.11,13.34 16.09,13.4 | 16.27,13.26 16.23,13.22 | 15.11,13.66 15.35,13.42 C53.2 | 16.29,13.68 C13.2 | 19.31,20.38 IC1.2 | 49.59,8 LED5.C 49.85,7.72 | C48.1 | 48.19,8.02 SW2.2 | 51.17,4.6 R8.1 | 49.87,23.86 C45.1 48.95,23.85 | C8.2 | 52.15,20.34 IC2.16 | R16.1 47.91,16.26 | C52.1 | 48.35,11.84 SW1.2 48.43,12.06 | C51.1 47.39,10.84 | 50.45,15.76 R15.1 | R17.1 | C5.2 4.69,7.06 | 4.69,8.8 IC4.13 4.65,8.86 4.65,9.2 | R2.2 7.85,17.22 7.79,17.16 | R1.2 9.01,17.28 | C1.2 | U$4.1 | 4.93,13.7 IC4.12 4.65,13.64 | 6.77,14.1 IC4.9 | 42.31,11.36 C50.1 | v25.73,2.36 25.75,2.34 | 22.23,1.42 IC1.39 | 40.15,11.35 40.63,11.4 IC1.89 | v36.07,5.66 36.03,5.7 | J1.1 6.49,1.76
  Top 0.254: IC1.22 18.51,10.36 18.25,10.1 18.25,9.45 C54.2 | IC1.89 42.31,11.36 42.4,11.45 | C19.2 43.55,10.28 C50.1 | 51.29,4.4 R8.1 | 52.15,20.34 51.13,20.34 48.95,22.37 | 42.28,21.68 42.23,21.92 v42.25,21.7 | 29.77,22.92 29.77,21.18 v29.85,21.1 | 26.75,22.3 v26.75,21.5
  Top 0.305: C26.1 51.29,4.4 | IC1.32 18.55,5.36 18.02,4.73 16.9,4.73 16.49,5.54 | 17.49,8.76 16.91,8.08 16.91,6.86 16.43,6.48 | C23.2 18.8,1.2 18.55,1 14.69,1 C4.2 | 35.75,23.42 35.51,23.96 33.49,23.96 33.25,23.42 33.06,23.96 29.89,23.96 29.77,23.44 | IC1.136 25.25,22.05 24.25,21.2 v23.7,21.2 22.43,20.38 19.31,20.38 | 16.29,18.56 16.57,18.56 C9.2 | 16.29,18.56 R28.2 | IC1.2 18.41,20.36 17.21,19.16 | 14.77,18.74 14.77,21.3 | C53.2 16.09,13.4 C13.2 | C22.2 16.63,12.82 16.23,13.22 16.11,13.34 | IC1.16 18.37,13.36 18.27,13.26 16.27,13.26 | 15.11,13.66 12.21,13.66 | 16.29,13.68 16.29,18.56 | 49.59,8 SW2.2 | 51.17,4.6 51.17,6.4 49.85,7.72 | 49.87,23.86 C8.2 | 48.95,23.85 48.95,22.37 48.92,22.32 v48.6,22 | C46.1 41.75,23 41.95,22.55 42.28,21.68 | C51.1 48.35,11.84 | 48.43,12.06 LED6.C | 47.91,16.26 47.91,17.2 v47.65,17.65 | R1.2 R2.2 | 7.79,17.16 6.95,17.16 | 6.95,17.16 C1.2 | 6.95,17.16 6.95,15.74 6.81,15.3 6.81,14.16 IC4.9 | 9.01,17.28 U$4.1 | IC1.64 34.75,4.42 36.03,5.7 39.34,9.86 IC1.86 | IC1.39 IC1.38 | 25.75,2.34 IC1.46 | v22.23,2.36 22.23,1.42 | 40.15,11.35 39.75,11.45 v39.65,12.39 | R17.1 7.59,6.36 v8.15,5.8 | 4.65,9.2 4.65,10.25 5.1,10.7 | 6.77,14.1 6.77,12.52 | IC4.12 4.67,13.32 4.8,13.32 4.8,12.35 | C42.2 15.1,21.35 15.1,21.45 v15.95,21.45 | C48.1 44.01,7.61 v44,7.4 | 48.19,8.02 48.19,8.71 v48.15,8.85 | C51.1 v48.35,10.9 | C52.1 47.41,14.96 47.9,15.45 R16.1 | R15.1 50.2,16.1 v49.65,16.65 | 42.15,22.05 v42.25,21.7 C17.2 41.94,20.55 41.7,20.55 41.51,20.36 IC1.107 | IC1.103 42.09,18.36 v42.65,17.8 | IC1.65 34.86,1.36 34.85,1.35 IC1.64
  Top 0.406: 12.24,8.53 12.24,7.25 | C6.2 12.99,4.06 12.99,2.24 13.69,2.24 | 12.59,7.18 13.2,7.17 13.65,6 | 13.65,4.17 13.65,6 | 13.65,6 v13.7,6 16.41,6 | 12.11,13.74 C2.2 | 4.69,8.8 4.69,7.06
  Top 1.016: 14.73,23.76 C42.2
  Bottom 0.127: v25.73,2.36 v22.23,2.36 | v39.65,12.39 39.19,12.34 39.07,12.46 38.19,12.46 38.05,12.32 38.05,11.18 C11.2
  Bottom 0.254: v48.6,22 48.65,22 48.7,22.05 | v42.25,21.7 42.3,21.55 | v23.7,21.2 23.75,21.15 | v29.85,21.1 29.85,21.05 | v26.75,21.5 26.75,21.55
  Bottom 0.305: v25.73,2.36 25.98,4.1 C47.1 | R34.1 v47.65,17.65 | v8.15,5.8 7.5,5.9 7.45,5.95 | v15.95,21.45 15.85,21.45 | v44,7.4 44,7.7 | v48.15,8.85 48.2,8.7 | v48.35,10.9 48.3,10.9 | 48.4,12.8 48.35,12.75 | v49.65,16.65 49.7,16.6 | v42.65,17.8 42.6,17.85
  Bottom 0.406: v13.7,6 13.85,6 13.9,5.95
  other vias: 5.5,12 5.45,10.65 8.45,11.95 8.45,10.65 11.65,12 11.65,10.6 6.85,12 6.8,10.65 10.3,11.95 10.25,10.65
  pour Bottom: 0.25,24.95 55.75,24.95 55.85,0.25 0.25,0.25
N$1  (via drill 0.2)
  Top 0.127: v50.77,21.76 51.39,21.76 51.51,21.64 52.15,21.64 IC2.18 | v47.75,3.22 47.75,2.58 L1.1
  Bottom 0.127: v50.77,21.76 51.39,21.76 52.01,21.14 52.01,9.98 49.67,7.64 49.67,5.14 v47.75,3.22
N$2  (via drill 0.2)
  Top 0.254: IC1.50 v27.75,6.2
  Bottom 0.254: v27.75,6.2 27.75,7.95 IC3.1
N$3
  Top 0.254: IC4.6 8.74,15.74 R1.1
N$4
  Top 0.254: IC4.7 8.1,15.05 7.9,15.25 R2.1
N$5  (via drill 0.2)
  Top 0.254: IC1.49 27.25,5.65 27.1,5.8 27.1,8.85 25.9,10.05 v23.95,10.05
  Bottom 0.254: v23.95,10.05 23.95,7.99 IC3.4
N$6  (via drill 0.2)
  Top 0.127: v51.29,21.22 51.53,20.98 52.15,20.98 IC2.17 | L1.3 v46.59,7.62
  Bottom 0.127: v51.29,21.22 51.29,20.66 51.75,20.2 51.75,10.58 48.85,7.6 46.85,7.62 v46.59,7.62
N$7  (via drill 0.2)
  Top 0.127: 8.79,8.3 IC4.19 8.69,8.36 | R17.2 8.85,6.9 | v12.05,5.3 12.59,5.84 R3.1 | IC4.18 | 9.41,14.16 IC4.5
  Top 0.305: 8.79,8.3 R17.2 | 8.85,6.9 v10.45,6.9 | 8.69,8.36 IC4.18 | v9.41,15.14 9.41,14.16
  Bottom 0.127: v12.05,5.3 v10.45,6.9 10.43,6.96 9.41,7.98 v9.41,15.14
N$8
  Top 0.254: IC1.20 18.51,11.36 18.4,11.25 17.1,11.25 16.75,10.9 XT1.3 15.9,10.95 15.4,11.45 15.4,12.15 15.45,12.2 C53.1 15.3,12.3
N$9
  Top 0.254: IC1.21 18.2,10.85 17.7,10.35 C54.1 17,10.35 16.75,10.1 16.75,8.9 16.4,8.55 15.2,8.55 14.25,9.5 XT1.1
N$10
  Bottom 0.127: IC3.7 26.67,13.9 26.67,16.22 R5.2 26.8,16.73 25.55,17.93 X6.1
N$11
  Bottom 0.127: IC3.6 25.09,13.3 R5.1 25.05,16.08 25.05,20.92 25.19,21.06 26.31,21.06 26.55,20.42 X6.2
N$12  (via drill 0.2)
  Top 0.127: v45.21,20.34 46.33,20.34 IC2.5
  Bottom 0.127: R9.1 33.31,20.32 34.57,19.06 43.93,19.06 v45.21,20.34
N$13  (via drill 0.2)
  Top 0.127: v45.45,19.6 46.27,19.6 46.33,19.66 IC2.6
  Bottom 0.127: v45.45,19.6 44.65,18.8 34.47,18.8 33.99,19.28 R10.1
N$14  (via drill 0.2)
  Top 0.127: v49.29,9.26 R35.2 | v41.85,15.88 40.77,15.88 IC1.98
  Bottom 0.127: v49.29,9.26 48.75,9.26 42.13,15.88 v41.85,15.88
N$15  (via drill 0.2)
  Top 0.127: v49.71,12.1 R36.2 | v42.15,16.66 41.51,16.66 41.31,16.86 IC1.100
  Bottom 0.127: v49.71,12.1 46.71,12.1 v42.15,16.66
N$16  (via drill 0.2)
  Top 0.127: v47.21,18.42 46.61,19.02 46.35,19.02 IC2.7
  Bottom 0.127: v47.21,18.42 33.03,18.42 32.81,18.2 R11.1
N$17
  Top 0.127: 49.91,3.18 R6.1
  Top 0.254: 49.91,3.18 50.07,3.18 50.1,3.15 50,3.15 50.05,3.2 | R8.2 51.25,3.15 | 52.15,3.15 C26.2
  Top 0.305: R7.2 49.91,3.18 | R6.1 R8.2 | 51.25,3.15 52.15,3.15
N$18
  Top 0.254: R12.2 46.31,17.75 IC2.9
N$19
  Top 0.254: R13.2 44.9,18.4 46.31,18.4 IC2.8
N$20
  Top 0.254: R14.2 45.46,21.65 IC2.3
N$21  (via drill 0.2)  (1 unrouted)
  Top 0.305: IC1.68 36.75,3.3 v37.1,3.65
  Bottom 0.305: v37.1,3.65 41.85,3.65 43.35,5.15
N$22  (via drill 0.2)
  Top 0.305: IC1.69 37.25,2.45 v37.65,3
  Bottom 0.305: v37.65,3 43,3 44.55,4.25 X7.2
N$23
  Top 0.254: R15.2 51.75,16.66 IC2.11
N$24
  Top 0.254: R16.2 46.6,16.81 IC2.10
N$53
  Top 0.127: LED3.C 13.69,17.24 | R28.1
  Top 0.305: 13.69,17.24 R28.1
N$55  (via drill 0.2)
  Top 0.127: v30.47,19.04 30.47,21.78 30.25,22.3 IC1.126
  Bottom 0.127: v30.47,19.04 R11.2
N$56  (via drill 0.2)
  Top 0.127: v32.01,21.24 32.01,21.54 31.25,22.3 IC1.124
  Bottom 0.127: v32.01,21.24 R9.2
N$57  (via drill 0.2)
  Top 0.127: v30.93,20.82 30.93,21.82 30.75,22.3 IC1.125
  Bottom 0.127: R10.2 31.29,20.46 v30.93,20.82
N$58
  Top 0.254: R31.1 51.75,14.56 LED4.A
N$59
  Top 0.254: LED4.C 49.83,14.82 49.1,15.55 49.1,17.45 50.05,18.4 52.14,18.4 IC2.13
N$60  (via drill 0.2)
  Top 0.127: v50.55,19.9 51.01,19.66 52.15,19.66 IC2.15
  Bottom 0.127: R33.2 R34.2 | v50.55,19.9 50.56,19.85 49.58,20.67
  Bottom 0.305: 49.58,20.67 R33.2
N$61
  Top 0.127: R35.1 51.65,9.2
  Top 0.254: LED5.A 51.92,8.93 51.65,9.2 51.65,9.3
N$62
  Top 0.254: LED6.A 51.97,11.88 R36.1
N$63  (via drill 0.2)
  Top 0.254: IC1.54 29.75,3 30.15,3.4 30.15,7.9 31.6,9.35 v35.75,9.35
  Bottom 0.254: v35.75,9.35 35.75,7.61 IC5.1
N$64
  Top 0.254: IC1.85 42.58,9.36 R37.1 42.8,9.14 C48.2
N$65  (via drill 0.2)
  Top 0.254: IC1.58 31.75,2.8 v32.35,3.4
  Bottom 0.127: 34.21,3.7 R39.1 34.1,3.7
  Bottom 0.254: v32.35,3.4 32.95,3.4 33.25,3.7 34.1,3.7 34.15,3.75 34.2,3.75 34.3,3.65
N$66
  Top 0.127: IC1.143 21.75,23.42 21.51,23.66 19.51,23.66 LED7.C
N$67
  Top 0.127: R38.2 17.65,23.26 LED7.A
N$68  (via drill 0.2)
  Top 0.254: IC1.55 30.25,2.4 30.95,3.1 v30.95,7.5
  Bottom 0.254: v30.95,7.5 31.9,7.5 IC5.4
N$69
  Bottom 0.127: R40.2 34.54,14.38 IC5.7 34.55,12.76
  Bottom 0.305: 34.55,12.76 34.55,11.35 35.7,11.35 38.94,8.01 38.94,6.49 X5.1
N$70
  Bottom 0.127: R40.1 33.24,14.16 33.23,12.82 IC5.6 33.27,12.76 33.32,11.82
  Bottom 0.305: 33.32,11.82 34.23,10.86 35.25,10.86 37.94,8.12 37.94,6.59 X5.2
NHET8  (via drill 0.2)
  Top 0.254: v37.45,21.55 37.25,21.75 IC1.112
  Bottom 0.254: X8.2 38.7,20.75 38.15,21.3 37.7,21.3 v37.45,21.55
NHET15  (via drill 0.2)
  Top 0.254: v37,20.85 36.75,21.2 IC1.113
  Bottom 0.305: X8.1 37.7,20.15 v37,20.85
RS_CAN1  (via drill 0.2)
  Top 0.127: v41.75,17.36 IC1.101
  Bottom 0.127: v41.75,17.36 40.45,17.36 39.93,17.78 37.11,17.78 35.85,16.62 31.17,16.62 27.75,13.2 IC3.8
RS_CAN2  (via drill 0.2)
  Top 0.127: IC1.102 39.89,17.86 v39.7,17.17
  Bottom 0.127: v39.7,17.17 39.7,16.73 IC5.8
RTCK  (via drill 0.2)
  Top 0.127: v18.25,3.86 IC1.35
  Bottom 0.127: v18.25,3.86 19.37,3.86 20.43,2.8 21.23,2.8 23.19,4.76 X3.1
SCIRX  (via drill 0.2)
  Top 0.254: IC1.52 v28.75,4
  Bottom 0.254: v28.75,4 30.7,4 30.95,4.15 X2.2 30.95,5.15
SCITX  (via drill 0.2)
  Top 0.254: IC1.53 v29.3,3.4
  Bottom 0.127: 31.95,5.14 X2.1 31.95,5.05
  Bottom 0.254: v29.3,3.4 31,3.4 31.9,4.3 31.95,5.05
SPI1CLK  (via drill 0.2)
  Top 0.127: IC1.17 18.31,12.86 v18.25,12.7
  Route15 0.127: v18.25,12.7 18.25,14.8 20.61,17.16 v20.61,17.24
  Bottom 0.127: v20.61,17.24 20.61,20.02 X1.7
SPI1CS0  (via drill 0.2)
  Top 0.127: IC1.23 19.81,9.86 20.97,11.02 v20.97,15.48
  Bottom 0.127: v20.97,15.48 20.97,16.22 19.65,17.54 X1.6
SPI1CS1  (via drill 0.2)
  Top 0.127: IC1.24 19.81,9.36 21.23,10.78 21.23,15.1 21.43,15.3 21.43,15.66 21.15,15.94 20.79,15.94 20.25,15.4 v20.25,15.14
  Bottom 0.127: v20.25,15.14 20.25,15.94 18.65,17.54 X1.5
SPI1CS2  (via drill 0.2)
  Top 0.127: IC1.25 19.81,8.86 21.49,10.54 21.49,14.98 21.71,15.2 21.71,17.84 v21.07,18.48
  Route15 0.127: v18.31,21.24 v21.07,18.48
  Bottom 0.127: v18.31,21.24 18.31,21.08 17.65,20.42 X1.4
SPI1EN  (via drill 0.2)
  Top 0.127: IC1.18 19.81,12.36 20.25,12.8 v20.25,13.1
  Bottom 0.127: v20.25,13.1 20.25,13.22 18.35,15.12 18.35,18.02 16.65,19.72 X1.3
SPI1SIMO  (via drill 0.2)
  Top 0.127: IC1.14 18.69,14.36 v17.89,15.16
  Bottom 0.127: v17.89,15.16 17.89,17.48 15.65,19.72 X1.2
SPI1SOMI  (via drill 0.2)
  Top 0.127: IC1.13 18.69,14.86 18.35,15.2 18.35,16.02 v17,17.37
  Bottom 0.127: v17,17.37 14.65,19.72 X1.1
SWITCH1
  Top 0.127: 42.49,15.36 R41.2
  Top 0.254: IC1.97 42.49,15.36 42.69,15.36 42.7,15.35 | R41.2 42.6,15.25 43.15,14.6 44.55,14.6 SW1.3 45.5,14.08 C52.2
SWITCH2
  Top 0.254: IC1.96 41.64,14.86 R42.2 42.6,13.8 43.35,12.85 44.6,12.05 44.6,11.55 45.35,10.8 46.1,10.8 C51.2 45.4,10.1 SW2.3
TCK  (via drill 0.2)
  Top 0.127: v20.25,6.36 IC1.30
  Bottom 0.127: v20.25,6.36 19.09,6.36 18.21,5.48 18.21,5.14 X3.6
TDI  (via drill 0.2)
  Top 0.127: IC1.34 19.85,4.36 v20.25,3.96
  Bottom 0.127: v20.25,3.96 20.01,3.96 19.21,4.76 X3.5
TDO  (via drill 0.2)
  Top 0.127: IC1.33 20.09,4.86 v20.99,3.96
  Bottom 0.127: v20.99,3.96 20.21,4.74 X3.4
TMS  (via drill 0.2)
  Top 0.127: IC1.36 20.51,3.36 v20.61,3.26
  Bottom 0.127: v20.61,3.26 20.93,3.26 21.45,3.78 21.45,4.88 X3.3
TRST  (via drill 0.2)
  Top 0.127: v20.81,6.86 IC1.29
  Bottom 0.127: v20.81,6.86 22.19,5.48 22.19,5.14 X3.2
VBAT  (via drill 0.2)
  Top 0.127: v50.64,19.02 52.15,19.02 IC2.14 | C43.1 | 11.25,23.8 U$4.3
  Top 1.016: U$4.3 8.27,23.63 v8.25,23.65 | 11.25,23.8 C43.1
  Route15 0.254: v8.25,23.65 26.9,23.65 27.8,22.75 44.85,22.75 48.75,18.85 v48.75,18.25
  Bottom 0.127: R33.1 49.65,18.87 49.79,17.95 C44.2 50.65,18 50.64,18.69 v50.64,19.02 | J1.2
  Bottom 0.254: v48.75,18.25 49.03,18.25 49.65,18.87 49.65,19.2 49.6,19.25 49.6,19.45
  Bottom 1.016: v8.25,23.65 4.1,19.5 4.1,6.65 J1.2 6.45,4.3

### Text on the board
Top: BRL 2013 J.Welsby | MYO GANGLION v1.0